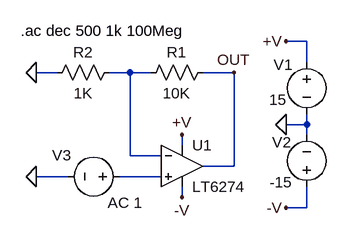
[diagram p0: schematic Fig_4-10_AC_6274.asc]
Fig_4-10_AC_6274.asc, the LTspice schematic file:
Version 4
SHEET 1 880 680
WIRE 528 -160 496 -160
WIRE 528 -128 528 -160
WIRE 144 -112 112 -112
WIRE 256 -112 224 -112
WIRE 288 -112 256 -112
WIRE 416 -112 368 -112
WIRE 528 -32 528 -48
WIRE 528 -32 496 -32
WIRE 528 -16 528 -32
WIRE 336 0 336 -16
WIRE 256 16 256 -112
WIRE 304 16 256 16
WIRE 416 32 416 -112
WIRE 416 32 368 32
WIRE 160 48 112 48
WIRE 304 48 240 48
WIRE 336 80 336 64
WIRE 528 96 528 64
WIRE 528 96 496 96
FLAG 496 -32 0
FLAG 496 -160 +V
FLAG 496 96 -V
FLAG 336 -16 +V
FLAG 336 80 -V
FLAG 112 -112 0
FLAG 112 48 0
FLAG 416 -112 OUT
SYMBOL voltage 528 -144 R0
WINDOW 0 -51 20 Left 2
WINDOW 3 -58 74 Left 2
SYMATTR InstName V1
SYMATTR Value 15
SYMBOL voltage 528 80 R180
WINDOW 0 24 85 Left 2
WINDOW 3 22 23 Left 2
SYMATTR InstName V2
SYMATTR Value -15
SYMBOL res 384 -128 R90
WINDOW 0 0 56 VBottom 2
WINDOW 3 32 56 VTop 2
SYMATTR InstName R1
SYMATTR Value 10K
SYMBOL voltage 256 48 R90
WINDOW 123 40 -19 VRight 2
WINDOW 39 0 0 Left 2
WINDOW 0 -33 90 VRight 2
SYMATTR Value2 AC 1
SYMATTR InstName V3
SYMATTR Value ""
SYMBOL res 240 -128 R90
WINDOW 0 0 56 VBottom 2
WINDOW 3 32 56 VTop 2
SYMATTR InstName R2
SYMATTR Value 1K
SYMBOL opamps\\LT6274 336 32 R0
SYMATTR InstName U1
TEXT 88 -176 Left 2 !.ac dec 500 1k 100Meg

The netlist it stands for:
* Fig_4-10_AC_6274.asc
V1 +V 0 15
V2 -V 0 -15
R1 OUT N001 10K
V3 N002 0 AC 1
R2 N001 0 1K
* U1: LT6274 (symbol opamps\LT6274 not available, pins judged from their places): In+=N002 In-=N001 V+=+V V-=-V OUT=OUT
.ac dec 500 1k 100Meg
.backanno
.end